# EAGLE design ESP32_mainboard (EAGLE 8.3.2)

## Sheet 1 of 2
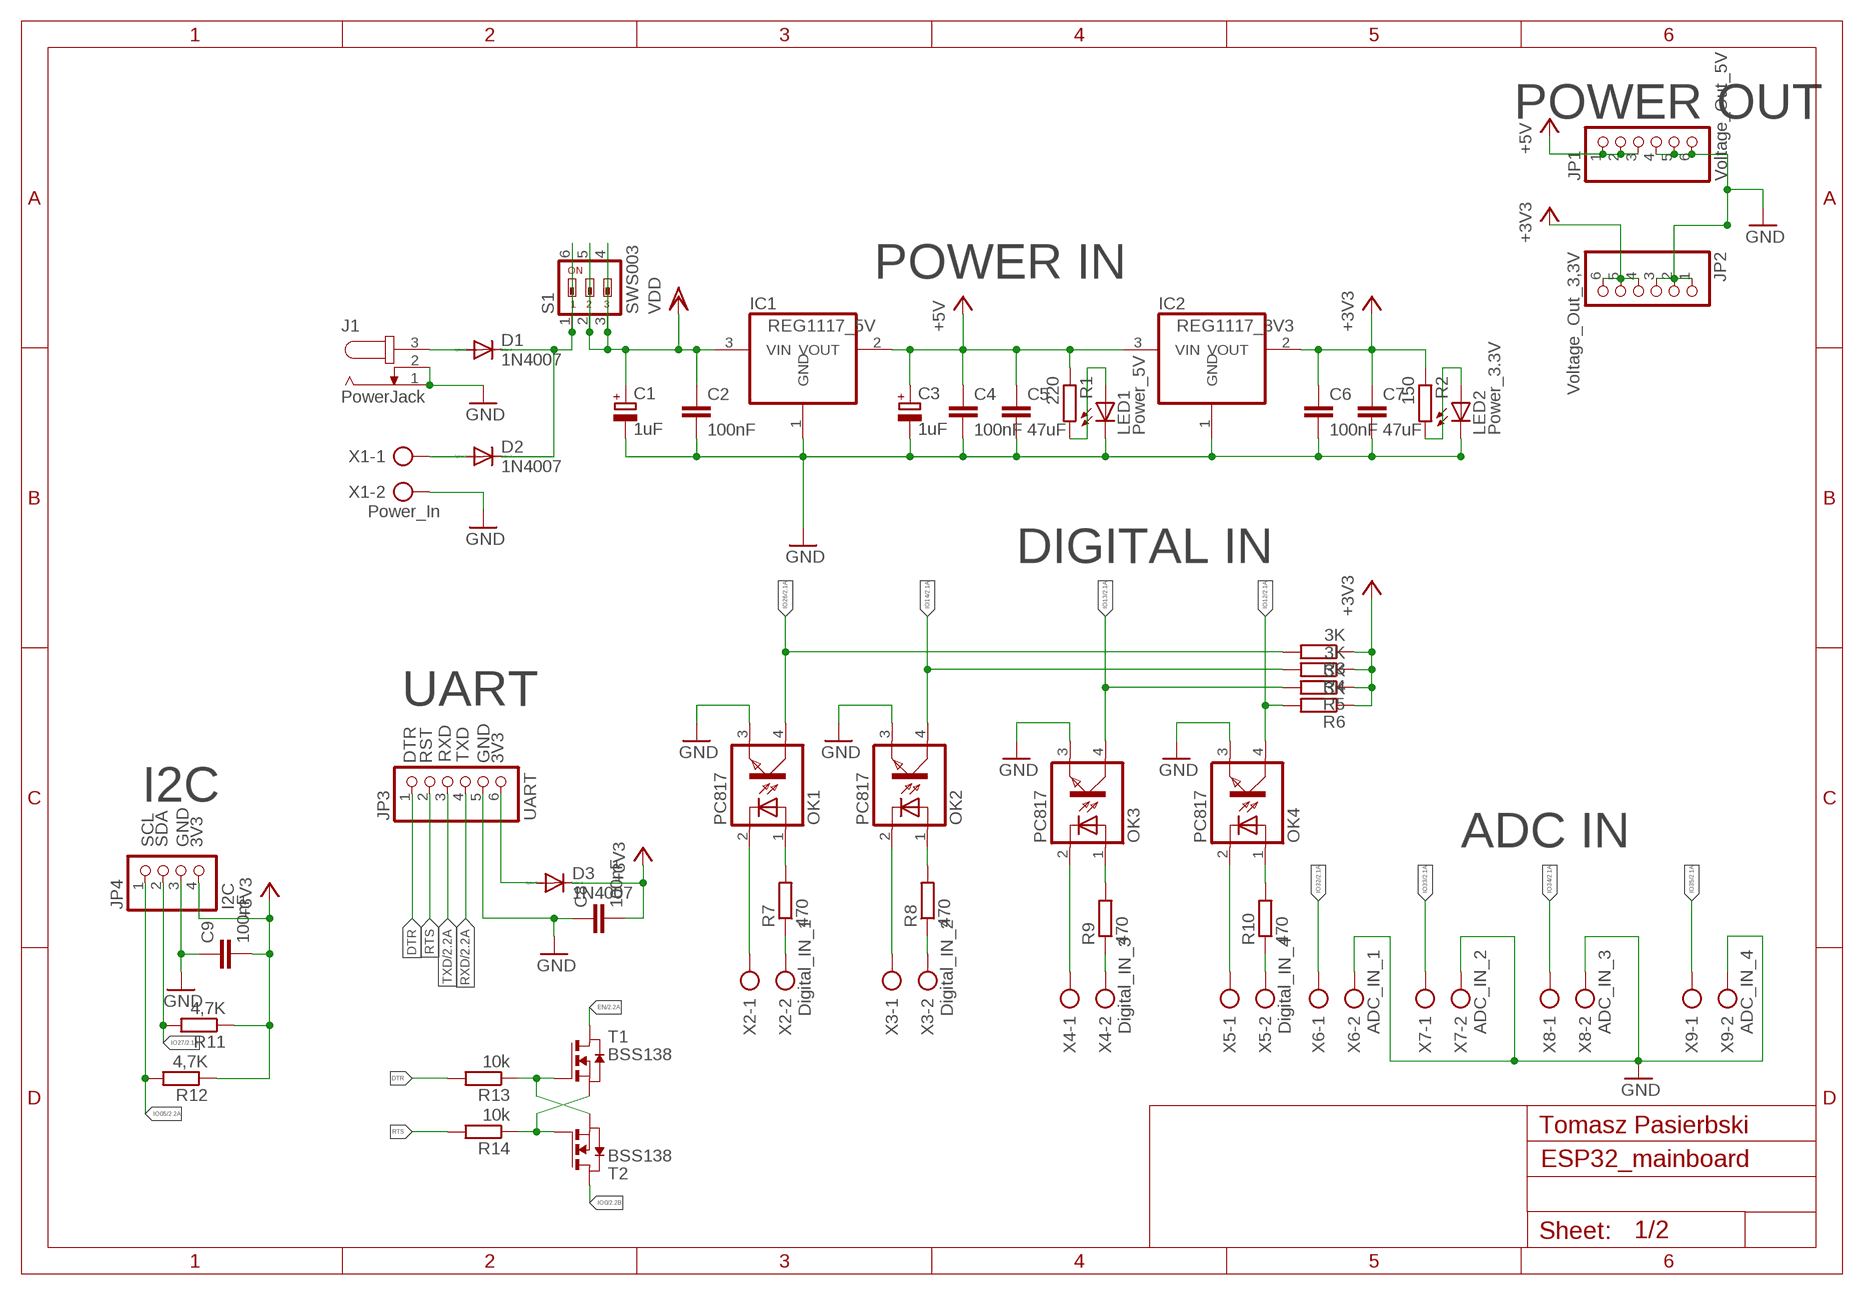
[diagram p0: schematic, sheet 1]

### Parts
C1  1uF  CPOL-EU140CLH-0810  [140CLH-0810]
C2  100nF  C-EUC1206  [C1206]
C3  1uF  CPOL-EU140CLH-0810  [140CLH-0810]
C4  100nF  C-EUC1206  [C1206]
C5  47uF  C-EUC1808  [C1808]
C6  100nF  C-EUC1206  [C1206]
C7  47uF  C-EUC1808  [C1808]
C8  100nF  C-EUC1206  [C1206]
C9  100nF  C-EUC1206  [C1206]
D1  1N4007  DIODE-DO214AA  [DO214AA]
D2  1N4007  DIODE-DO214AA  [DO214AA]
D3  1N4007  DIODE-DO214AA  [DO214AA]
IC1  REG1117_5V  REG1117  [SOT223]
IC2  REG1117_3V3  REG1117  [SOT223]
J1  PowerJack  JACK-PLUG0  [SPC4077]
JP1  Voltage_Out_5V  PINHD-1X6/90  [1X06/90]
JP2  Voltage_Out_3,3V  PINHD-1X6/90  [1X06/90]
JP3  UART  PINHD-1X6/90  [1X06/90]
JP4  I2C  PINHD-1X4/90  [1X04/90]
LED1  Power_5V  LEDCHIPLED_1206  [CHIPLED_1206]
LED2  Power_3.3V  LEDCHIPLED_1206  [CHIPLED_1206]
OK1  PC817  [DIL04]
OK2  PC817  [DIL04]
OK3  PC817  [DIL04]
OK4  PC817  [DIL04]
R1  220  R-EU_M1206  [M1206]
R2  150  R-EU_M1206  [M1206]
R3  3K  R-EU_M1206  [M1206]
R4  3K  R-EU_M1206  [M1206]
R5  3K  R-EU_M1206  [M1206]
R6  3K  R-EU_M1206  [M1206]
R7  470  R-EU_M1206  [M1206]
R8  470  R-EU_M1206  [M1206]
R9  470  R-EU_M1206  [M1206]
R10  470  R-EU_M1206  [M1206]
R11  4,7K  R-EU_M1206  [M1206]
R12  4,7K  R-EU_M1206  [M1206]
R13  10k  R-EU_M1206  [M1206]
R14  10k  R-EU_M1206  [M1206]
S1  SWS003  [SMS-003]
T1  BSS138  NMOSSOT23  [SOT-23]
T2  BSS138  NMOSSOT23  [SOT-23]
X1  Power_In  AK300/2  [AK300/2]
X2  Digital_IN_1  AK300/2  [AK300/2]
X3  Digital_IN_2  AK300/2  [AK300/2]
X4  Digital_IN_3  AK300/2  [AK300/2]
X5  Digital_IN_4  AK300/2  [AK300/2]
X6  ADC_IN_1  AK300/2  [AK300/2]
X7  ADC_IN_2  AK300/2  [AK300/2]
X8  ADC_IN_3  AK300/2  [AK300/2]
X9  ADC_IN_4  AK300/2  [AK300/2]

### Nets
+3V3: C6.1 C7.1 C8.2 C9.2 D3.C IC2.2(VOUT) JP2.4 JP2.5 JP2.6 JP4.4 R2.1 R3.1 R4.1 R5.1 R6.1 R11.1 R12.1 ; also sheet 2
+5V: C3.+ C4.1 C5.1 IC1.2(VOUT) IC2.3(VIN) JP1.1 JP1.2 JP1.3 R1.1 ; also sheet 2
DTR: JP3.1 R13.2
EN: T1.1(D) ; also sheet 2
GND: C1.- C2.2 C3.- C4.2 C5.2 C6.2 C7.2 C8.1 C9.1 IC1.1(GND) IC2.1(GND) J1.1 J1.2 JP1.4 JP1.5 JP1.6 JP2.1 JP2.2 JP2.3 JP3.5 JP4.3 LED1.C LED2.C OK1.3(EMIT) OK2.3(EMIT) OK3.3(EMIT) OK4.3(EMIT) X1.2 X6.2 X7.2 X8.2 X9.2 ; also sheet 2
IO0: T2.1(D) ; also sheet 2
IO05: JP4.1 R12.2 ; also sheet 2
IO12: OK4.4(COL) R6.2 ; also sheet 2
IO13: OK3.4(COL) R5.2 ; also sheet 2
IO14: OK2.4(COL) R4.2 ; also sheet 2
IO26: OK1.4(COL) R3.2 ; also sheet 2
IO27: JP4.2 R11.2 ; also sheet 2
IO32: X6.1 ; also sheet 2
IO33: X7.1 ; also sheet 2
IO34: X8.1 ; also sheet 2
IO35: X9.1 ; also sheet 2
N$1: D1.A J1.3
N$2: D1.C D2.C S1.1 S1.6
N$5: D2.A X1.1
N$22: D3.A JP3.6
N$24: LED1.A R1.2
N$32: LED2.A R2.2
N$39: OK3.2(C) X4.1
N$50: OK3.1(A) R9.2
N$58: OK1.2(C) X2.1
N$61: R13.1 T1.3(G) T2.2(S)
N$62: R14.1 T1.2(S) T2.3(G)
N$68: R9.1 X4.2
N$69: OK4.2(C) X5.1
N$70: OK4.1(A) R10.2
N$71: R10.1 X5.2
N$72: OK2.2(C) X3.1
N$73: OK2.1(A) R8.2
N$74: R8.1 X3.2
N$78: OK1.1(A) R7.2
N$79: R7.1 X2.2
RTS: JP3.2 R14.2
RXD: JP3.4 ; also sheet 2
TXD: JP3.3 ; also sheet 2
VDD: C1.+ C2.1 IC1.3(VIN) S1.2 S1.3 S1.4 S1.5 ; also sheet 2

### Notes on the sheet
- POWER OUT
- POWER IN
- DIGITAL IN
- UART
- DTR | RST | RXD | TXD | GND | 3V3
- I2C
- SCL | SDA | GND | 3V3 | ADC IN
- Tomasz Pasierbski

## Sheet 2 of 2
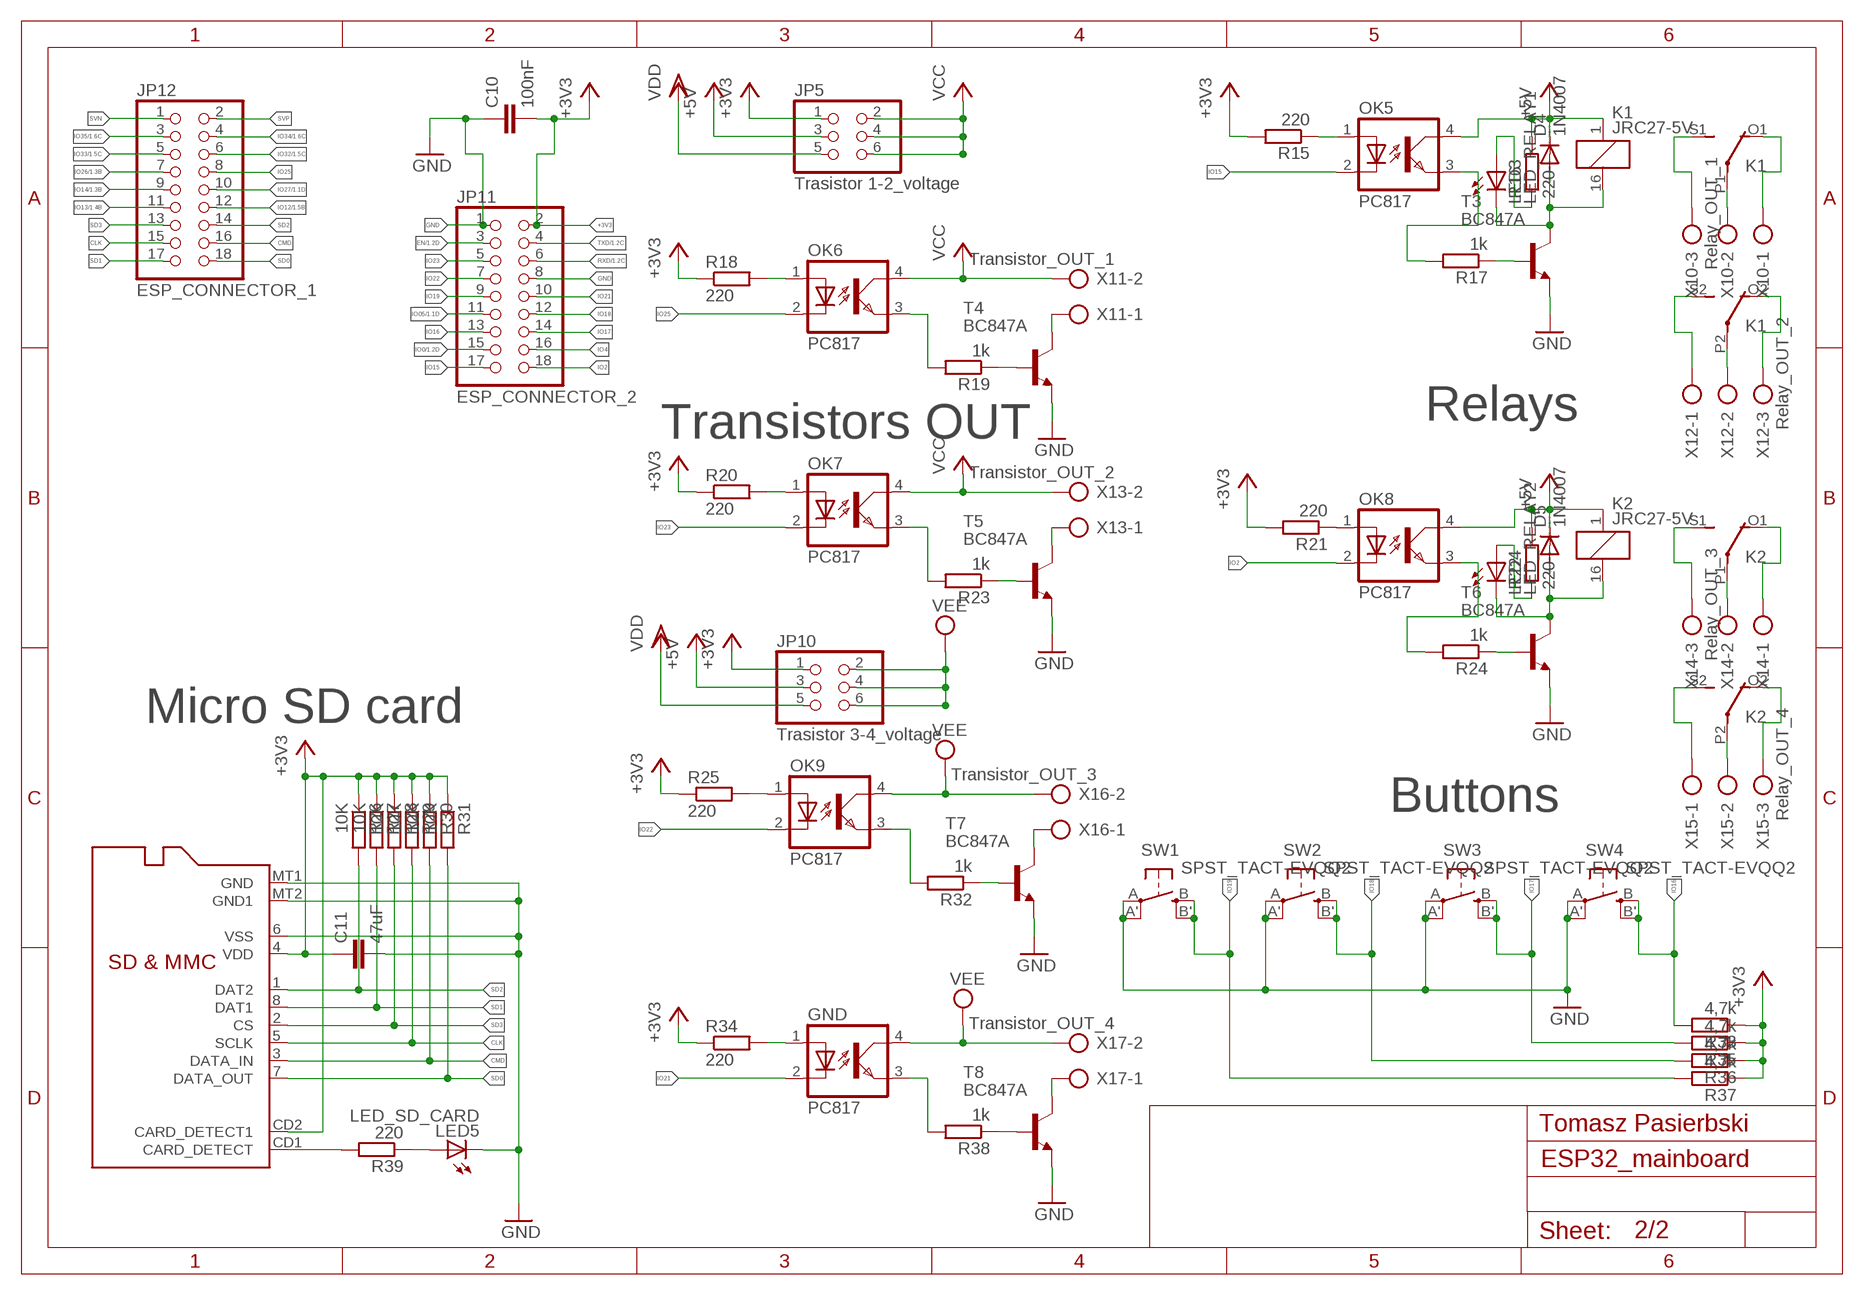
[diagram p1: schematic, sheet 2]

### Parts
C10  100nF  C-EUC1206  [C1206]
C11  47uF  C-EUC1808  [C1808]
D4  1N4007  DIODE-DO214AC  [DO214AC]
D5  1N4007  DIODE-DO214AC  [DO214AC]
GND  PC817  [DIL04]
JP5  Trasistor 1-2_voltage  PINHD-2X3  [2X03]
JP10  Trasistor 3-4_voltage  PINHD-2X3  [2X03]
JP11  ESP_CONNECTOR_2  PINHD-2X9  [2X09]
JP12  ESP_CONNECTOR_1  PINHD-2X9  [2X09]
K1  JRC27-5V  351  [351]
K2  JRC27-5V  351  [351]
LED3  LED_RELAY1  LEDCHIPLED_1206  [CHIPLED_1206]
LED4  LED_RELAY2  LEDCHIPLED_1206  [CHIPLED_1206]
LED5  LED_SD_CARD  LEDCHIPLED_1206  [CHIPLED_1206]
OK5  PC817  [DIL04]
OK6  PC817  [DIL04]
OK7  PC817  [DIL04]
OK8  PC817  [DIL04]
OK9  PC817  [DIL04]
R15  220  R-EU_M1206  [M1206]
R16  220  R-EU_M1206  [M1206]
R17  1k  R-EU_M1206  [M1206]
R18  220  R-EU_M1206  [M1206]
R19  1k  R-EU_M1206  [M1206]
R20  220  R-EU_M1206  [M1206]
R21  220  R-EU_M1206  [M1206]
R22  220  R-EU_M1206  [M1206]
R23  1k  R-EU_M1206  [M1206]
R24  1k  R-EU_M1206  [M1206]
R25  220  R-EU_M1206  [M1206]
R26  10K  R-EU_M1206  [M1206]
R27  10K  R-EU_M1206  [M1206]
R28  10K  R-EU_M1206  [M1206]
R29  10K  R-EU_M1206  [M1206]
R30  10K  R-EU_M1206  [M1206]
R31  10K  R-EU_M1206  [M1206]
R32  1k  R-EU_M1206  [M1206]
R33  4,7k  R-EU_M1206  [M1206]
R34  220  R-EU_M1206  [M1206]
R35  4,7k  R-EU_M1206  [M1206]
R36  4,7k  R-EU_M1206  [M1206]
R37  4,7k  R-EU_M1206  [M1206]
R38  1k  R-EU_M1206  [M1206]
R39  220  R-EU_M1206  [M1206]
SW1  SPST_TACT-EVQQ2  [EVQ-Q2]
SW2  SPST_TACT-EVQQ2  [EVQ-Q2]
SW3  SPST_TACT-EVQQ2  [EVQ-Q2]
SW4  SPST_TACT-EVQQ2  [EVQ-Q2]
T3  BC847A  BC847-NPN-SOT23-BEC  [SOT23-BEC]
T4  BC847A  BC847-NPN-SOT23-BEC  [SOT23-BEC]
T5  BC847A  BC847-NPN-SOT23-BEC  [SOT23-BEC]
T6  BC847A  BC847-NPN-SOT23-BEC  [SOT23-BEC]
T7  BC847A  BC847-NPN-SOT23-BEC  [SOT23-BEC]
T8  BC847A  BC847-NPN-SOT23-BEC  [SOT23-BEC]
U2  MICROSD  [MICROSD]
X10  Relay_OUT_1  AK300/3  [AK300/3]
X11  Transistor_OUT_1  AK300/2  [AK300/2]
X12  Relay_OUT_2  AK300/3  [AK300/3]
X13  Transistor_OUT_2  AK300/2  [AK300/2]
X14  Relay_OUT_3  AK300/3  [AK300/3]
X15  Relay_OUT_4  AK300/3  [AK300/3]
X16  Transistor_OUT_3  AK300/2  [AK300/2]
X17  Transistor_OUT_4  AK300/2  [AK300/2]

### Nets
+3V3: C10.2 C11.1 JP5.1 JP10.1 JP11.2 R15.2 R18.1 R20.1 R21.2 R25.1 R26.1 R27.1 R28.1 R29.1 R30.1 R31.1 R33.1 R34.1 R35.1 R36.1 R37.1 U2.4(VDD) U2.CD2(CARD_DETECT1) ; also sheet 1
+5V: D4.C D5.C JP5.3 JP10.3 K1.1 K2.1 OK5.4(COL) OK8.4(COL) R16.2 R22.2 ; also sheet 1
CLK: JP12.15 R29.2 U2.5(SCLK)
CMD: JP12.16 R30.2 U2.3(DATA_IN)
EN: JP11.3 ; also sheet 1
GND: C10.1 C11.2 JP11.1 JP11.8 LED5.C SW1.A'(P1) SW1.A(P) SW2.A'(P1) SW2.A(P) SW3.A'(P1) SW3.A(P) SW4.A'(P1) SW4.A(P) T3.E T4.E T5.E T6.E T7.E T8.E U2.6(VSS) U2.MT1(GND) U2.MT2(GND1) ; also sheet 1
IO0: JP11.15 ; also sheet 1
IO2: JP11.18 OK8.2(C)
IO4: JP11.16
IO05: JP11.11 ; also sheet 1
IO12: JP12.12 ; also sheet 1
IO13: JP12.11 ; also sheet 1
IO14: JP12.9 ; also sheet 1
IO15: JP11.17 OK5.2(C)
IO16: JP11.13 R33.2 SW4.B'(S1) SW4.B(S)
IO17: JP11.14 R35.2 SW3.B'(S1) SW3.B(S)
IO18: JP11.12 R36.2 SW2.B'(S1) SW2.B(S)
IO19: JP11.9 R37.2 SW1.B'(S1) SW1.B(S)
IO21: GND.2(C) JP11.10
IO22: JP11.7 OK9.2(C)
IO23: JP11.5 OK7.2(C)
IO25: JP12.8 OK6.2(C)
IO26: JP12.7 ; also sheet 1
IO27: JP12.10 ; also sheet 1
IO32: JP12.6 ; also sheet 1
IO33: JP12.5 ; also sheet 1
IO34: JP12.4 ; also sheet 1
IO35: JP12.3 ; also sheet 1
N$6: K1.S1(2:S) X10.3
N$7: K1.O1(2:O) X10.1
N$8: K1.P1(2:P) X10.2
N$9: K1.S2(3:S) X12.1
N$10: K1.P2(3:P) X12.2
N$11: K1.O2(3:O) X12.3
N$12: K2.O1(2:O) X14.1
N$13: K2.S1(2:S) X14.3
N$14: K2.P1(2:P) X14.2
N$15: K2.S2(3:S) X15.1
N$16: K2.O2(3:O) X15.3
N$17: K2.P2(3:P) X15.2
N$18: OK8.1(A) R21.1
N$19: OK5.1(A) R15.1
N$25: R17.1 T3.B
N$26: OK5.3(EMIT) R17.2
N$27: OK8.3(EMIT) R24.2
N$28: D4.A K1.16 LED3.C T3.C
N$30: R24.1 T6.B
N$37: LED3.A R16.1
N$42: OK6.1(A) R18.2
N$43: OK7.1(A) R20.2
N$46: D5.A K2.16 LED4.C T6.C
N$47: LED4.A R22.1
N$51: R19.1 T4.B
N$52: OK6.3(EMIT) R19.2
N$53: R39.2 U2.CD1(CARD_DETECT)
N$54: T4.C X11.1
N$55: R23.1 T5.B
N$56: OK7.3(EMIT) R23.2
N$57: T5.C X13.1
N$59: LED5.A R39.1
N$63: OK9.1(A) R25.2
N$64: R32.1 T7.B
N$65: OK9.3(EMIT) R32.2
N$66: T7.C X16.1
N$67: GND.1(A) R34.2
N$75: R38.1 T8.B
N$76: GND.3(EMIT) R38.2
N$77: T8.C X17.1
RXD: JP11.6 ; also sheet 1
SD0: JP12.18 R31.2 U2.7(DATA_OUT)
SD1: JP12.17 R27.2 U2.8(DAT1)
SD2: JP12.14 R26.2 U2.1(DAT2)
SD3: JP12.13 R28.2 U2.2(CS)
SVN: JP12.1
SVP: JP12.2
TXD: JP11.4 ; also sheet 1
VCC: JP5.2 JP5.4 JP5.6 OK6.4(COL) OK7.4(COL) X11.2 X13.2
VDD: JP5.5 JP10.5 ; also sheet 1
VEE: GND.4(COL) JP10.2 JP10.4 JP10.6 OK9.4(COL) X16.2 X17.2

### Notes on the sheet
- Relays
- Transistors OUT
- Micro SD card
- Buttons
- Tomasz Pasierbski

## Library data of the parts
C1 C3 = rcl:CPOL-EU: POLARIZED CAPACITOR, European symbol
C2 C4-C11 = rcl:C-EU: CAPACITOR, European symbol
D1-D5 = diode:DIODE-: DIODE
GND OK1-OK9 = optocoupler:PC817: SHARP OPTO COUPLER; MPN: PC817X4J000F; OC_FARNELL: 9707727; OC_NEWARK: 97K7059
IC1 IC2 = burr-brown:REG1117: 800mA and 1A Low Dropout (LDO) Positive Regulator 1.8V, 2.5V, 2.85V, 3.3V, 5V, and Adj; MPN: REG1117; OC_FARNELL: 1097566; OC_NEWARK: 14P6981
J1 = con-jack:JACK-PLUG: DC POWER JACK Power Jack, DC, Right Angle, Through Hole, Rated 5A at 16VDC, PC Terminals Distributor: Farnell (www.Farnell.de) Drawing: 84N1161.pdf / 84N1162.pdf Manufacturer: SPC Technology (www.spctechnology.com) Type: SPC4077 / SPC 4078; OC_FARNELL: unknown; OC_NEWARK: unknown
JP1-JP3 = pinhead:PINHD-1X6: PIN HEADER
JP4 = pinhead:PINHD-1X4: PIN HEADER
JP5 JP10 = pinhead:PINHD-2X3: PIN HEADER
JP11 JP12 = pinhead:PINHD-2X9: PIN HEADER
K1 K2 = relay:351: RELAY 2 x switch, Omron; OC_FARNELL: unknown; OC_NEWARK: unknown
LED1-LED5 = led:LED: LED OSRAM: - CHIPLED LG R971, LG N971, LY N971, LG Q971, LY Q971, LO R971, LY R971 LH N974, LH R974 LS Q976, LO Q976, LY Q976 LO Q996 - Hyper CHIPLED LW Q18S LB Q993, LB Q99A, LB R99A - SideLED LS A670, LO A670, LY A670, LG A670, LP A670 LB A673, LV A673, LT A673, LW A673 LH A674 LY A675 LS A676, LA A676, LO A676, LY A676, LW A676 LS A679, LY A679, LG A679 - Hyper Micro SIDELED® LS Y876, LA Y876, LO Y876, LY Y876 LT Y87S - SmartLED LW L88C, LW L88S LB L89C, LB L89S, LG L890 LS L89K, LO L89K, LY L89K LS L896, LA L896, LO L896, LY L896 - TOPLED LS T670, LO T670, LY T670, LG T670, LP T670 LSG T670, LSP T670, LSY T670, LOP T670, LYG T670 LG T671, LOG T671, LSG T671 LB T673, LV T673, LT T673, LW T673 LH T674 LS T676, LA T676, LO T676, LY T676, LB T676, LH T676, LSB T676, LW T676 LB T67C, LV T67C, LT T67C, LS T67K, LO T67K, LY T67K, LW E67C LS E67B, LA E67B, LO E67B, LY E67B, LB E67C, LV E67C, LT E67C LW T67C LS T679, LY T679, LG T679 LS T770, LO T770, LY T770, LG T770, LP T770 LB T773, LV T773, LT T773, LW T773 LH T774 LS E675, LA E675, LY E675, LS T675 LS T776, LA T776, LO T776, LY T776, LB T776 LHGB T686 LT T68C, LB T68C - Hyper Mini TOPLED® LB M676 - Mini TOPLED Santana® LG M470 LS M47K, LO M47K, LY M47K Source: http://www.osram.convergy.de LUXEON: - LUMILED® LXK2-PW12-R00, LXK2-PW12-S00, LXK2-PW14-U00, LXK2-PW14-V00 LXK2-PM12-R00, LXK2-PM12-S00, LXK2-PM14-U00 LXK2-PE12-Q00, LXK2-PE12-R00, LXK2-PE12-S00, LXK2-PE14-T00, LXK2-PE14-U00 LXK2-PB12-K00, LXK2-PB12-L00, LXK2-PB12-M00, LXK2-PB14-N00, LXK2-PB14-P00, LXK2-PB14-Q00 LXK2-PR12-L00, LXK2-PR12-M00, LXK2-PR14-Q00, LXK2-PR14-R00 LXK2-PD12-Q00, LXK2-PD12-R00, LXK2-PD12-S00 LXK2-PH12-R00, LXK2-PH12-S00 LXK2-PL12-P00, LXK2-PL12-Q00, LXK2-PL12-R00 Source: www.luxeon.com KINGBRIGHT: KA-3528ASYC Source: www.kingbright.com
R1-R39 = rcl:R-EU_: RESISTOR, European symbol
S1 = smd-special:SWS003: SMD Dip Switch 3 pol.
SW1-SW4 = adafruit:SPST_TACT: SMT 6mm switch, EVQQ2 series http://www.ladyada.net/library/eagle
T1 T2 = zetex:NMOSSOT23: MOS FET; OC_FARNELL: unknown; OC_NEWARK: unknown
T3-T8 = transistor:*-NPN-: NPN Transistror BF959 corrected 2008.03.06
U2 = adafruit:MICROSD: Micro-SD / Transflash card holder with SPI pinout For the 3M # 2908-05WB-MG and/or 4UCON #19656 push-push type
X1-X9 X11 X13 X16 X17 = con-ptr500:AK300/2: CONNECTOR; OC_FARNELL: unknown; OC_NEWARK: unknown
X10 X12 X14 X15 = con-ptr500:AK300/3: CONNECTOR; OC_FARNELL: unknown; OC_NEWARK: unknown

## Board
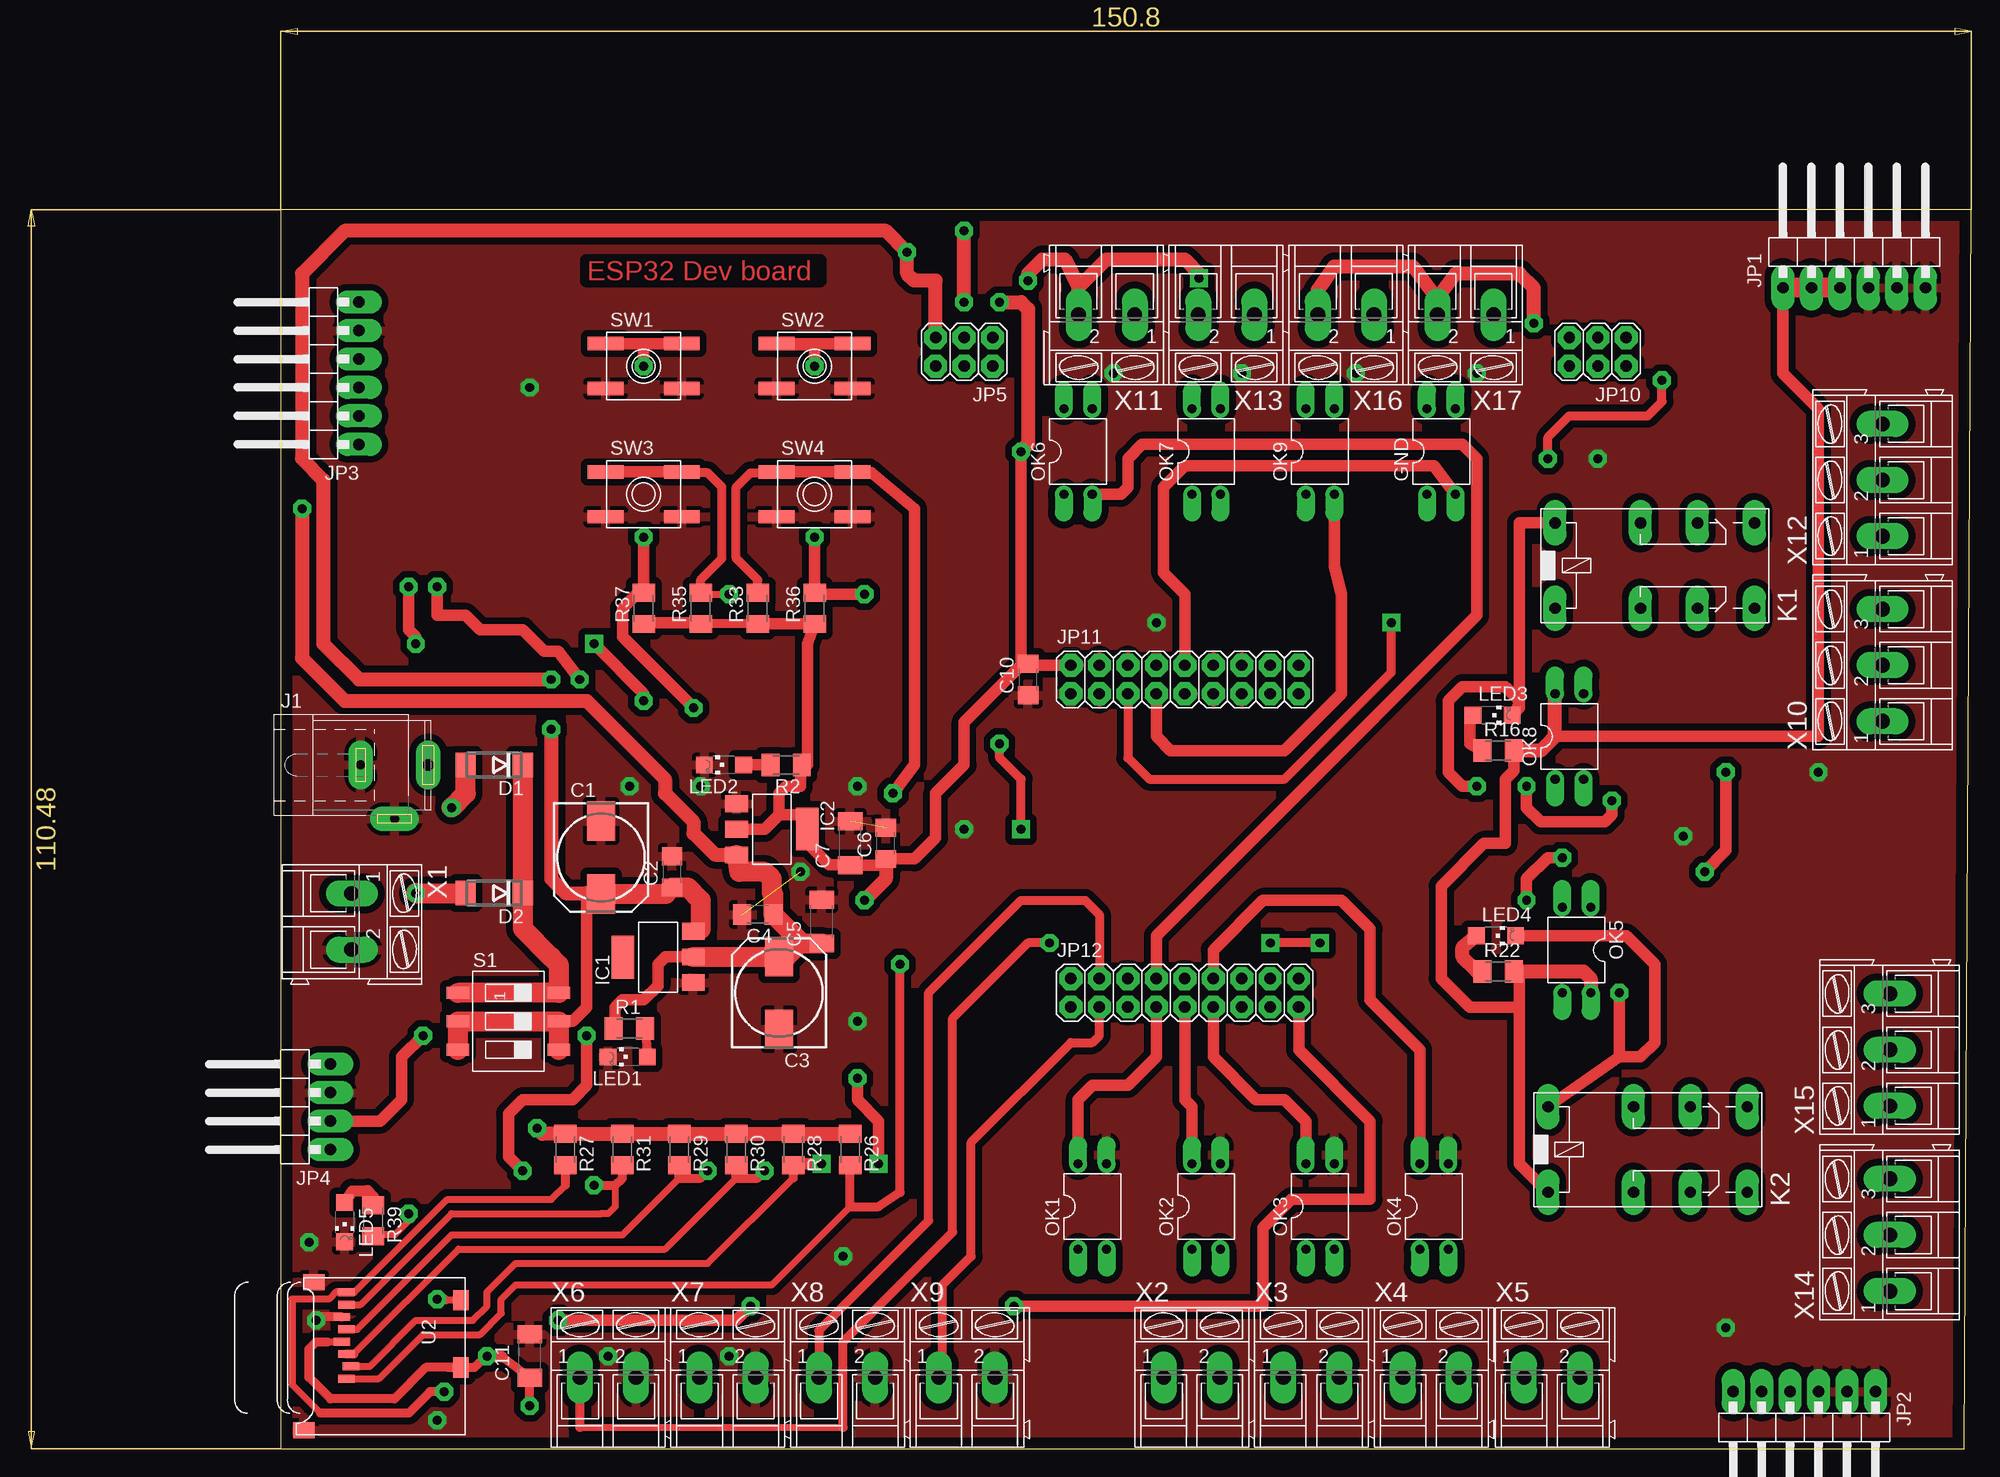
[diagram p2: board, top side]
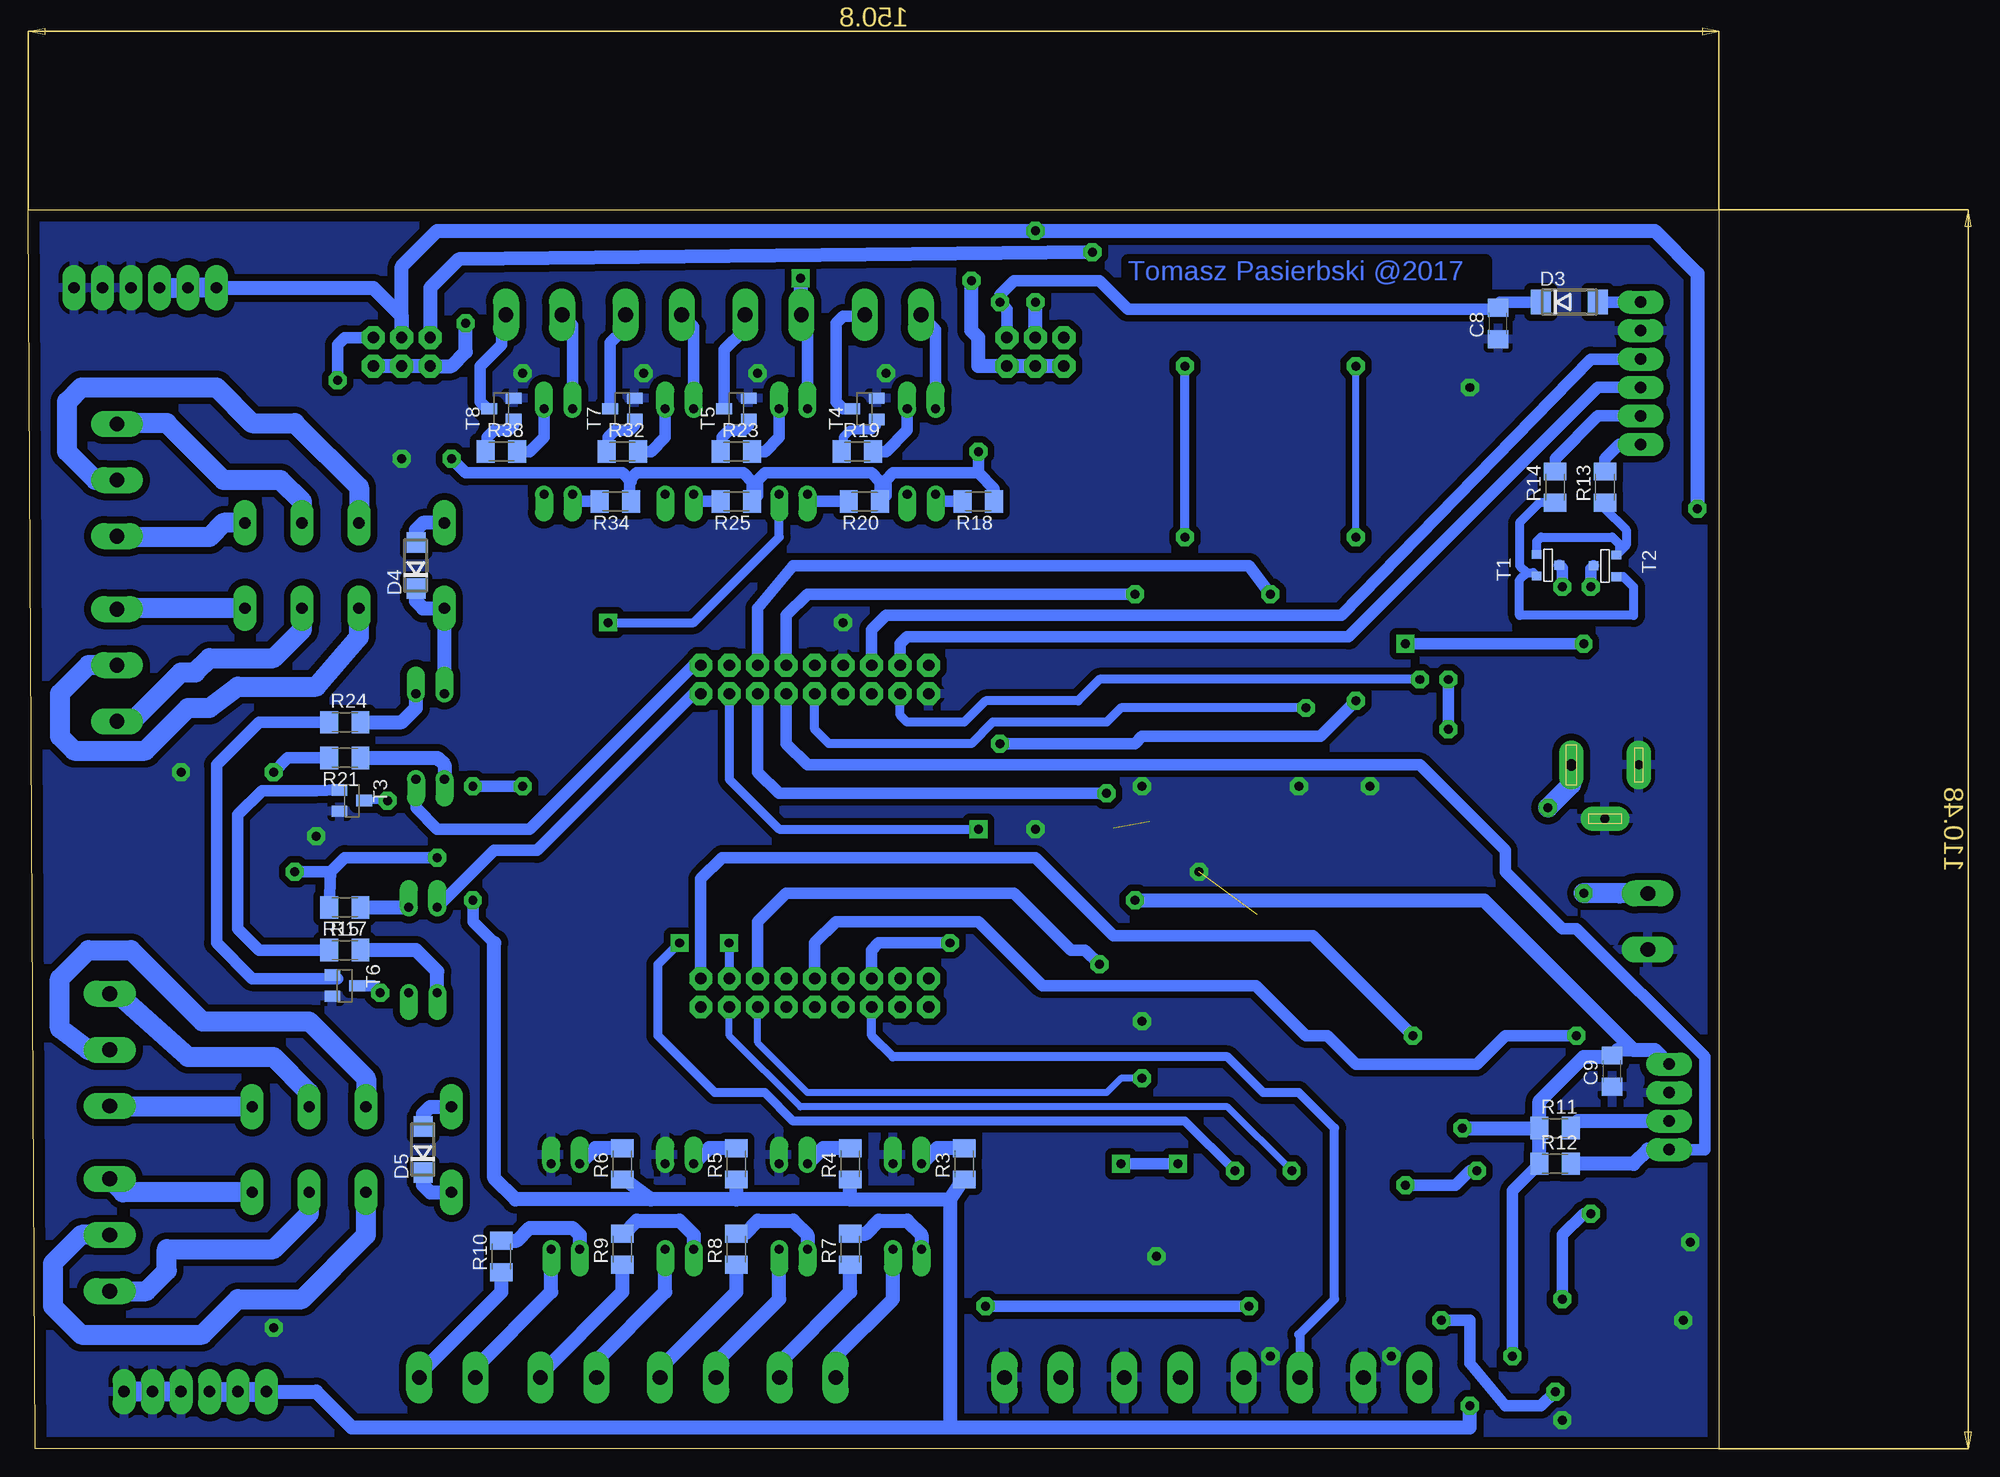
[diagram p3: board, bottom side, seen from below]

Size 150.8 x 110.48 mm. Coordinates in mm from the lower left corner, seen from the top.
Outline: 0,0 150.16,0 150.8,110.48 0,110.48 0,0
Copper layers (1*16): Top 0.035mm / dielectric 1.5mm / Bottom 0.035mm
Design rules "default *": minimum track width 20mil, minimum drill 24mil, track to track 12mil, track to pad 12mil, pad to pad 12mil, via to via 12mil, smd to smd 12mil, copper to edge 40mil, drill to drill 12mil, minimum pad ring 10mil, minimum via ring 8mil, stop-mask expansion 4mil, vias tented up to drill 0mil, thermal gap 15mil

### Footprints (pad centres in the part's own frame; a part is rotated, then mirrored left to right if it is on the bottom)
140CLH-0810 = smd 3.5 x 2.5: + 3.25,0; - -3.25,0
C1206 = smd 1.6 x 1.8: 1 -1.4,0; 2 1.4,0
C1808 = smd 1.6 x 2.2: 1 -1.95,0; 2 1.95,0
DO214AA = smd 1.8 x 2.2: A 2.55,0; C -2.55,0
DO214AC = smd 1.8 x 1.7: A 2.05,0; C -2.05,0
DIL04 = drill 0.813 offset: 1 -1.27,-3.81; 2 1.27,-3.81; 3 1.27,3.81; 4 -1.27,3.81
SOT223 = smd 1.499 x 2.007: 1 -2.261,-3.15; 2 0.025,-3.15; 3 2.311,-3.15 | smd 3.81 x 2.007: 4 0,3.15
SPC4077 = drill 0.8 pad 2.184 long: 1 -3,0; 2 0,-4.8 | drill 1 pad 2.184 long: 3 3,0
1X06/90 = drill 1.016 long: 1 -6.35,-3.81; 2 -3.81,-3.81; 3 -1.27,-3.81; 4 1.27,-3.81; 5 3.81,-3.81; 6 6.35,-3.81
1X04/90 = drill 1.016 long: 1 -3.81,-3.81; 2 -1.27,-3.81; 3 1.27,-3.81; 4 3.81,-3.81
2X03 = drill 1.016 octagon: 1 -2.54,-1.27; 2 -2.54,1.27; 3 0,-1.27; 4 0,1.27; 5 2.54,-1.27; 6 2.54,1.27
2X09 = drill 1.016 octagon: 1 -10.16,-1.27; 2 -10.16,1.27; 3 -7.62,-1.27; 4 -7.62,1.27; 5 -5.08,-1.27; 6 -5.08,1.27; 7 -2.54,-1.27; 8 -2.54,1.27; 9 0,-1.27; 10 0,1.27; 11 2.54,-1.27; 12 2.54,1.27; 13 5.08,-1.27; 14 5.08,1.27; 15 7.62,-1.27; 16 7.62,1.27; 17 10.16,-1.27; 18 10.16,1.27
351 = drill 1.016 long: 1 -3.81,-3.81; 16 -3.81,3.81; O1 8.89,-3.81; O2 8.89,3.81; P1 3.81,-3.81; P2 3.81,3.81; S1 13.97,-3.81; S2 13.97,3.81
CHIPLED_1206 = smd 1.5 x 1.5: A 0,-1.75; C 0,1.75
M1206 = smd 1.6 x 2: 1 -1.4,0; 2 1.4,0
SMS-003 = smd 1.092 x 2.007: 1 -2.54,-4.496; 2 0,-4.496; 3 2.54,-4.496; 4 2.54,4.496; 5 0,4.496; 6 -2.54,4.496
EVQ-Q2 = smd 3.2 x 1.2: A -3.4,-2; A' 3.4,-2; B -3.4,2; B' 3.4,2
SOT-23 = smd 0.787 x 0.889: 1 0.025,-1.016; 2 -0.94,1.016; 3 0.991,1.016
SOT23-BEC = smd 1 x 1.4: B -0.95,-1.1; C 0,1.1; E 0.95,-1.1
MICROSD = smd 0.7 x 1.5: 1 9,-10.64; 2 7.9,-10.24; 3 6.8,-10.64; 4 5.7,-11.04; 5 4.6,-10.64; 6 3.5,-11.04; 7 2.4,-10.64; 8 1.3,-10.64 | smd 1.8 x 1.4: CD1 2,-0.44; CD2 8,-0.44 | smd 1.4 x 1.9: MT1 0.4,-13.54; MT2 13.6,-14.44
AK300/2 = drill 1.321 long: 1 -2.515,0; 2 2.489,0
AK300/3 = drill 1.321 long: 1 -5.004,0; 2 0,0; 3 5.004,0

### Placement (x,y rotation side)
C1  28.57,52.7 270 top
C2  34.92,51.44 90 top
C3  44.45,40.64 90 top
C4  42.55,47.62 180 top
C5  48.26,46.99 90 top
C6  53.98,53.98 90 top
C7  50.8,53.98 90 top
C8  19.68,100.33 90 bottom
C9  9.53,33.66 90 bottom
C10  66.67,68.58 90 top
C11  22.23,8.26 90 top
D1  19.05,60.96 180 top
D2  19.05,49.53 180 top
D3  13.34,102.23 0 bottom
D4  116.2,78.74 90 bottom
D5  115.57,26.67 90 bottom
GND  103.5,88.9 0 top
IC1  33.66,43.81 90 top
IC2  43.81,55.24 270 top
J1  10.16,60.96 0 top
JP1  140.34,107.31 0 top
JP2  135.89,1.27 180 top
JP3  3.17,95.89 90 top
JP4  0.64,30.48 90 top
JP5  60.96,97.79 180 top
JP10  117.47,97.79 180 top
JP11  80.64,68.58 0 top
JP12  80.64,40.64 0 top
K1  117.47,78.74 0 top
K2  116.84,26.67 0 top
LED1  30.96,34.92 90 top
LED2  39.54,60.96 90 top
LED3  108.09,65.41 270 top
LED4  108.4,45.72 270 top
LED5  5.71,20.2 180 top
OK1  72.39,21.59 0 top
OK2  82.55,21.59 0 top
OK3  92.71,21.59 0 top
OK4  102.87,21.59 0 top
OK5  115.57,44.45 180 top
OK6  71.12,88.9 0 top
OK7  82.55,88.9 0 top
OK8  114.94,63.5 0 top
OK9  92.71,88.9 0 top
R1  31.11,37.47 0 top
R2  45.09,60.96 180 top
R3  67.31,25.4 90 bottom
R4  77.47,25.4 90 bottom
R5  87.63,25.4 90 bottom
R6  97.79,25.4 90 bottom
R7  77.47,17.78 90 bottom
R8  87.63,17.78 90 bottom
R9  97.79,17.78 90 bottom
R10  108.58,17.14 90 bottom
R11  14.61,28.57 0 bottom
R12  14.61,25.4 0 bottom
R13  10.16,85.72 90 bottom
R14  14.61,85.72 90 bottom
R15  122.56,48.26 180 bottom
R16  108.58,62.23 0 top
R17  122.56,44.45 0 bottom
R18  66.04,84.45 180 bottom
R19  76.83,88.9 0 bottom
R20  76.2,84.45 180 bottom
R21  122.56,61.59 180 bottom
R22  108.58,42.55 0 top
R23  87.63,88.9 0 bottom
R24  122.56,64.77 0 bottom
R25  87.63,84.45 180 bottom
R26  50.8,26.67 270 top
R27  25.4,26.67 270 top
R28  45.72,26.67 270 top
R29  35.56,26.67 270 top
R30  40.64,26.67 270 top
R31  30.48,26.67 270 top
R32  97.79,88.9 0 bottom
R33  42.55,74.93 90 top
R34  98.42,84.45 180 bottom
R35  37.47,74.93 90 top
R36  47.62,74.93 90 top
R37  32.38,74.93 90 top
R38  108.58,88.9 0 bottom
R39  8.26,20.32 270 top
S1  20.32,38.1 270 top
SW1  32.38,96.52 0 top
SW2  47.62,96.52 0 top
SW3  32.38,85.09 0 top
SW4  47.62,85.09 0 top
T1  15.24,78.74 90 bottom
T2  10.16,78.74 270 bottom
T3  121.92,57.78 270 bottom
T4  76.2,92.71 90 bottom
T5  87.63,92.71 90 bottom
T6  122.56,41.27 270 bottom
T7  97.79,92.71 90 bottom
T8  108.58,92.71 90 bottom
U2  16.51,15.24 270 top
X1  6.35,46.99 270 top
X2  81.28,6.35 0 top
X3  91.95,6.35 0 top
X4  102.62,6.35 0 top
X5  113.41,6.35 0 top
X6  29.21,6.35 0 top
X7  39.88,6.35 0 top
X8  50.55,6.35 0 top
X9  61.21,6.35 0 top
X10  142.88,69.85 90 top
X11  73.66,101.09 180 top
X12  142.88,86.36 90 top
X13  84.33,101.09 180 top
X14  143.51,19.05 90 top
X15  143.51,35.56 90 top
X16  95,101.09 180 top
X17  105.66,101.09 180 top

### Tracks (layer width: path | path; a pad name or v marks a point on that pad's centre or on a via)
+3V3  (via drill 0.8)
  Top 0.61: 36.96,73.53 36.83,73.66 | 32.52,73.66 R37.1 | 4.18,9.53 U2.4 | U2.CD2 14.98,7.24
  Top 0.813: R33.1 38.1,73.53 | 38.1,73.53 R35.1 | R35.1 36.96,73.53 | U2.CD2 12.96,7.24 10.16,4.45 4.45,4.45 2.54,6.35 2.54,8.89 3.17,9.53 4.18,9.53 | 19.73,8.21 C11.1 v22.23,3.81 | v18.41,8.26 17.27,7.24 14.98,7.24 | v113.03,88.27 113.03,90.17 114.94,92.08 121.92,92.08 123.19,93.34 v123.19,95.25 | R35.1 37.47,73.66 38.1,73.53
  Top 1.016: R33.1 R36.1 46.99,71.75 46.99,60.96 R2.1 46.35,60.83 46.35,59.05 45.09,59.05 44.45,58.42 44.45,56.52 | 36.83,73.66 32.52,73.66 | IC2.2 43.16,55.22 44.45,56.52 | 44.45,56.52 46.99,56.52 46.99,53.98 48.9,52.07 50.76,52.07 C7.1 53.42,52.02 C6.1 56.52,52.58 58.42,54.48 58.42,58.42 60.96,60.96 60.96,64.77 66.04,69.85 | 19.73,8.21 v18.41,8.26 | 71.12,69.85 JP11.2 67.31,69.85 C10.2 66.04,69.85 | v66.04,88.9 66.04,69.85 | v127,51.44 128.91,53.34 v128.91,60.33 | v114.3,52.7 113.03,52.7 111.12,50.8 v111.12,48.9
  Top 1.27: R26.1 R28.1 R30.1 R29.1 R31.1 R27.1 23.36,28.07 v22.86,28.57 | C6.1 53.98,50.8 v52.07,48.9 | v64.14,102.23 66.04,102.23 66.67,101.6 66.67,89.53 v66.04,88.9
  Bottom 0.813: 74.3,84.96 R20.1 | 97.16,84.58 R34.1 97.03,86.23 | 20.32,101.6 C8.2 | 67.31,24.13 R3.1 | 97.79,24.13 R6.1
  Bottom 1.016: D3.C 19.55,102.23 C8.2 | v18.41,8.26 18.41,22.99 R12.1 | R18.1 64.64,85.59 66.04,87 | 66.04,87 73.66,87 74.3,86.36 74.3,84.96 | R20.1 74.8,86.23 75.56,87 85.09,87 85.72,86.36 85.72,84.96 R25.1 86.23,86.23 87,87 96.52,87 97.16,86.36 97.16,84.58 | 97.03,86.23 97.79,87 111.76,87 v113.03,88.27 | v123.19,95.25 123.19,98.42 122.56,99.06 JP10.1 | JP5.1 63.5,101.6 v64.14,102.23 64.14,102.87 62.87,104.14 55.24,104.14 52.7,101.6 20.32,101.6 | v66.04,88.9 66.04,87 | 123.83,51.44 122.56,52.7 v114.3,52.7 | 123.83,51.44 R15.2 | R21.2 127.64,61.59 v128.91,60.33 | v127,51.44 123.83,51.44 | v111.12,48.9 111.12,46.99 109.22,45.09
  Bottom 1.27: JP4.4 5.71,35.56 7.62,35.56 | 7.62,35.56 9.02,35.56 C9.2 9.65,34.92 12.06,34.92 16,30.98 R11.1 | R12.1 R11.1 | v22.86,28.57 R11.1 | v52.07,48.9 20.95,48.9 7.62,35.56 | JP2.6 125.09,5.08 121.92,1.91 68.58,1.91 | 68.58,1.91 22.23,1.91 v22.23,3.81 | 77.47,22.23 68.58,22.23 | 68.58,22.23 67.31,24.13 | 77.47,22.23 87.63,22.23 | 77.47,22.23 R4.1 | 87.63,22.23 95.25,22.23 | 95.25,22.23 97.79,24.13 | 87.63,22.23 R5.1 | 109.22,45.09 109.22,24.13 107.31,22.23 95.25,22.23 | 68.58,22.23 68.58,1.91
  Bottom 1.778: JP2.4 JP2.5 JP2.6
+5V  (via drill 0.8)
  Top 0.61: 29.84,37.59 R1.1
  Top 0.813: 110.49,41.91 R22.2
  Top 1.016: IC1.2 34.31,43.84 33.66,43.18 33.66,41.27 32.38,40.01 30.48,40.01 29.84,39.37 29.84,37.59 | K2.1 110.49,25.4 110.49,39.37 | 110.49,39.37 110.49,41.91 | JP1.1 133.99,95.89 137.16,92.71 137.16,63.5 113.79,63.5 113.35,63.18 | R16.2 109.98,60.45 109.22,59.69 109.22,53.98 107.31,53.98 103.5,50.16 103.5,41.91 106.05,39.37 110.49,39.37
  Top 1.27: v1.91,83.82 1.91,70.48 5.71,66.67 27.3,66.67 34.29,59.69 34.29,58.42 36.83,55.88 36.83,54.86 38.73,52.96 40.64,52.96 IC2.3 | v60.96,102.23 v60.96,108.58 | R16.2 112.39,62.23 113.35,63.18 113.67,63.5 OK8.4 | R22.2 116.2,42.55 116.84,41.91 OK5.4
  Top 1.778: IC1.2 44.4,43.84 C3.+ 45.16,43.89 46.35,45.09 | 46.35,45.09 46.35,45.22 C4.1 43.95,49.4 43.81,49.53 43.81,50.8 43.18,51.44 40.89,51.44 IC2.3 | C5.1 46.4,45.04 46.35,45.09 | JP1.3 JP1.1
  Bottom 1.27: JP1.1 120.02,103.5 117.47,100.97 JP10.3 117.47,105.41 114.3,108.58 v60.96,108.58 5.71,108.58 1.91,104.78 v1.91,83.82 | D5.C 115.57,23.5 114.94,22.86 K2.1 | D4.C 116.2,75.56 115.57,74.93 K1.1 OK8.4 | JP5.3 v60.96,102.23
  Bottom 1.778: JP1.3 JP1.2 JP1.1
CLK  (via drill 0.8)
  Top 0.61: U2.5 6.83,10.64 15.24,19.05 30.48,19.05 35.56,24.13
  Top 0.813: R29.2 35.56,24.13 37.47,24.13 v38.1,24.77 | 88.27,38.73 JP12.15
  Bottom 0.61: JP12.15 88.27,36.83 81.92,30.48 43.81,30.48 v38.1,24.77
CMD  (via drill 0.8)
  Top 0.61: 6.54,8.44 15.88,17.78 34.29,17.78 40.64,24.13
  Top 0.813: U2.3 6.54,8.44 | R30.2 40.64,24.13 42.55,24.13 v43.18,24.77 | 88.27,42.55 JP12.16 | v92.71,45.09 v88.27,45.09
  Bottom 0.813: v88.27,45.09 JP12.16 | v43.18,24.77 47.62,29.21 82.55,29.21 85.09,31.75 89.53,31.75 94.61,36.83 94.61,43.18 v92.71,45.09
DTR
  Bottom 1.016: R13.2 10.16,88.27 8.89,89.53 JP3.1
EN  (via drill 0.8)
  Top 1.016: 73.03,66.67 JP11.3 | v26.67,68.58 24.77,71.12 23.5,71.12 21.59,73.03 17.78,73.03 16.51,74.3 13.97,74.3 v13.97,76.83
  Bottom 0.813: JP11.3 73.03,65.41 72.39,64.77 67.31,64.77 65.41,66.67 57.15,66.67 55.24,68.58 v26.67,68.58
  Bottom 1.016: v13.97,76.83 13.97,78.51 T1.1
GND  (via drill 0.8)  (2 unrouted)
  Top 0.813: U2.6 3.48,11.74 v3.17,11.43
  Bottom 1.778: JP2.3 JP2.1
  other vias: 74.3,95.89 85.72,95.89 95.89,95.89 106.68,95.89 51.44,59.05 46.35,51.44 60.96,55.24 125.09,54.61 137.16,60.33 128.91,10.79 31.11,59.05 37.47,59.05 78.11,73.66 117.47,88.27 29.21,8.26 40.01,8.26 2.54,18.41 50.16,17.14 13.97,2.54 51.44,38.1 22.23,94.61
  pour Bottom (isolate 0.61): -0.64,111.12 152.4,111.12 151.76,-1.27 -1.91,-1.27
  pour Top (isolate 0.61): -0.64,111.12 152.4,111.12 151.76,-1.27 -1.91,-1.27
IO0  (via drill 0.8)
  Top 0.813: v66.04,55.24 66.04,59.69 64.14,61.59 v64.14,62.87
  Top 1.016: v32.38,66.67 32.38,67.31 v27.94,71.75 | v12.06,71.75 12.06,72.39 11.43,73.03 v11.43,76.83
  Bottom 0.813: JP11.15 88.27,59.69 83.82,55.24 v66.04,55.24
  Bottom 1.016: v64.14,62.87 52.07,62.87 51.44,63.5 35.56,63.5 v32.38,66.67 | v11.43,76.83 11.43,78.46 T2.1 | v27.94,71.75 v12.06,71.75
IO2
  Top 0.813: 90.81,70.48 JP11.18
  Bottom 1.016: OK8.2 116.2,57.15 114.3,55.24 106.05,55.24 91.44,69.85 JP11.18
IO05
  Top 1.016: 83.19,66.67 JP11.11
  Bottom 1.016: JP11.11 83.19,62.87 81.28,60.96 26.67,60.96 19.05,53.34 19.05,51.44 13.97,46.35 12.7,46.35 1.27,34.92 1.27,26.67 JP4.1
  Bottom 1.27: JP4.1 6.35,26.67 7.62,25.4 R12.2
IO12
  Top 1.016: JP12.12 83.19,44.45 87.63,48.9 94.61,48.9 97.16,46.35 97.16,40.01 101.6,35.56 OK4.4
  Bottom 1.27: R6.2 100.2,26.8 OK4.4
IO13
  Top 1.016: JP12.11 83.19,34.92 87,31.11 89.53,31.11 91.44,29.21 OK3.4
  Bottom 1.27: R5.2 90.04,26.8 OK3.4
IO14
  Top 1.016: OK2.4 81.28,30.48 80.64,31.11 JP12.9
  Bottom 1.27: R4.2 79.88,26.8 OK2.4
IO15
  Top 0.813: 90.81,66.67 JP11.17
  Bottom 1.016: OK5.2 109.22,53.34 105.41,53.34 91.44,67.31 JP11.17
IO16  (via drill 0.8)
  Top 0.61: 44.13,87 SW4.B
  Top 0.813: R33.2 42.55,77.47 40.64,79.38 40.64,85.72 41.91,87 44.13,87
  Top 1.016: SW4.B SW4.B' 52.7,87 56.52,83.82 56.52,60.96 v54.61,58.42 | 85.72,66.67 JP11.13
  Bottom 1.016: JP11.13 85.72,60.33 83.82,58.42 v54.61,58.42
IO17  (via drill 0.8)
  Top 0.61: 35.88,87 SW3.B' | 38.1,76.2 v40.01,76.2
  Top 0.813: 35.88,87 38.1,87 39.37,85.72 39.37,79.38 37.47,77.47 R35.2 38.1,76.2
  Top 1.016: SW3.B' SW3.B | 85.72,70.48 JP11.14
  Bottom 1.016: JP11.14 85.72,74.93 82.55,78.74 41.91,78.74 v40.01,76.2
IO18  (via drill 0.8)
  Top 0.61: 44.32,98.42 SW2.B
  Top 0.813: 48.26,76.2 R36.2
  Top 1.016: R36.2 v47.62,81.28 | v47.62,96.52 47.62,98.42 44.32,98.42 | SW2.B' SW2.B | 83.19,70.48 JP11.12 | 48.26,76.2 v52.07,76.2
  Bottom 0.813: v47.62,81.28 v47.62,96.52
  Bottom 1.016: JP11.12 83.19,74.3 81.28,76.2 v52.07,76.2
IO19  (via drill 0.8)
  Top 0.813: 31.75,76.2 R37.2
  Top 1.016: SW1.B' 32.38,98.52 | 32.38,98.52 SW1.B | R37.2 v32.38,81.28 | v32.38,96.52 32.38,98.52 | 81.28,67.31 JP11.9 | v36.83,66.04 30.48,72.39 30.48,74.93 31.75,76.2
  Bottom 0.61: v32.38,81.28 v32.38,96.52
  Bottom 0.813: JP11.9 80.64,64.14 79.38,62.87 66.67,62.87 64.77,64.77 54.61,64.77 53.34,66.04 v36.83,66.04
IO21
  Top 1.016: GND.2 102.87,87.63 80.64,87.63 78.74,85.72 78.74,78.11 80.64,76.2 JP11.10
IO22
  Top 1.016: OK9.2 93.98,78.74 94.61,76.2 94.61,67.31 89.53,62.23 79.38,62.23 78.11,63.5 JP11.7
IO23  (via drill 0.8)
  Top 0.813: JP11.5 75.56,61.59 77.47,59.69 89.53,59.69 99.06,69.22 v99.06,73.66
  Bottom 0.813: v99.06,73.66 91.44,73.66 83.82,81.28 OK7.2
IO25
  Top 1.016: OK6.2 74.93,85.09 75.56,85.72 75.56,88.27 76.83,89.53 105.41,89.53 106.68,88.27 106.68,74.3 78.11,45.72 JP12.8
IO26
  Top 1.016: JP12.7 78.11,38.73 78.11,34.92 75.56,32.38 72.39,32.38 71.12,31.11 OK1.4
  Bottom 1.27: R3.2 69.72,26.8 OK1.4
IO27  (via drill 0.8)
  Top 0.813: 80.64,42.55 JP12.10 | 5.08,29.21 JP4.2
  Top 1.016: 5.08,29.21 8.89,29.21 10.79,31.11 10.79,34.92 v12.7,36.83
  Bottom 1.016: JP12.10 80.64,45.09 78.74,46.99 66.04,46.99 60.33,41.27 41.27,41.27 36.83,36.83 34.92,36.83 32.38,34.29 21.59,34.29 19.05,36.83 v12.7,36.83
  Bottom 1.27: JP4.2 12.57,29.21 R11.2
IO32  (via drill 0.8)
  Top 0.61: 26.67,1.91 50.16,1.91
  Top 0.813: 75.56,42.55 JP12.6 | 50.16,1.91 50.16,9.53 59.94,19.3 59.94,38.35 66.67,45.09 v68.58,45.09 | 26.67,1.91 26.67,5.08 X6.1
  Bottom 1.016: JP12.6 75.56,44.45 74.93,45.09 v68.58,45.09
IO33
  Top 0.813: 75.56,38.73 JP12.5
  Bottom 0.61: 37.47,10.16 37.36,10.06
  Bottom 0.813: JP12.5 75.56,36.83 73.66,34.92 43.81,34.92 40.64,31.75 37.47,31.75 34.29,28.57 34.29,13.34 37.47,10.16 | 37.36,10.06 X7.1
IO34
  Top 0.813: JP12.4 73.03,47.62 71.75,48.9 66.04,48.9 57.78,40.64 57.78,20.32 48.01,10.54 X8.1
IO35
  Top 0.813: 73.03,38.73 JP12.3 73.03,36.83 72.39,36.2 70.48,36.2 61.59,27.3 61.59,17.14 59.05,14.61 59.05,6.99 X9.1
N$1  (via drill 0.8)
  Top 1.778: v15.24,57.15 16.51,58.42 D1.A
  Bottom 1.778: J1.3 13.16,59.23 v15.24,57.15
N$2
  Top 1.778: D1.C D2.C 21.6,46.4 24.13,43.81 24.82,43.13 S1.6 S1.1
N$5  (via drill 0.8)
  Top 1.778: v12.06,49.53 D2.A
  Bottom 1.778: X1.1 8.87,49.51 v12.06,49.53
N$6
  Bottom 1.778: K1.S1 142.8,74.93 X10.3
N$7
  Bottom 1.778: X10.1 141.53,64.85 137.16,69.22 135.89,69.22 134.62,70.48 128.91,70.48 126.36,73.03 K1.O1
N$8
  Bottom 1.778: X10.2 145.41,69.85 147.96,67.31 147.96,63.5 146.69,62.23 140.34,62.23 136.53,66.04 134.62,66.04 132.08,67.94 125.09,67.94 121.28,72.39 K1.P1
N$9
  Bottom 1.778: K1.S2 133.35,82.55 134.62,81.28 142.8,81.28 X12.1
N$10
  Bottom 1.778: X12.2 144.78,86.36 147.32,88.9 147.32,93.34 146.05,94.61 133.99,94.61 130.81,91.44 127,91.44 121.28,85.72 K1.P2
N$11
  Bottom 1.778: K1.O2 126.36,84.45 128.27,86.36 133.35,86.36 138.43,91.44 142.8,91.44 X12.3
N$12
  Bottom 1.778: X14.1 140.26,14.05 138.43,15.88 138.43,17.78 128.91,17.78 125.73,20.95 K2.O1
N$13
  Bottom 1.778: K2.S1 142.32,22.86 X14.3
N$14
  Bottom 1.778: X14.2 146.05,19.05 148.59,16.51 148.59,12.7 146.05,10.16 135.25,10.16 132.08,13.34 126.36,13.34 120.65,19.05 K2.P1
N$15
  Bottom 1.778: K2.S2 143.43,30.48 X15.1
N$16
  Bottom 1.778: X15.3 142.8,40.56 136.53,34.92 128.91,34.92 125.73,31.75 K2.O2
N$17
  Bottom 1.778: X15.2 145.41,35.56 147.96,37.47 147.96,41.91 145.41,44.45 141.6,44.45 135.25,38.1 125.73,38.1 120.65,33.02 K2.P2
N$18
  Bottom 1.27: R21.1 114.3,61.59 113.67,60.96 OK8.1
N$19
  Bottom 1.27: R15.1 OK5.1
N$22
  Bottom 1.016: JP3.6 D3.A
N$24
  Top 0.813: R1.2 LED1.A
N$25
  Bottom 1.016: R17.1 130.18,44.45 132.08,46.35 132.08,56.52 129.92,58.67 125.09,58.67 T3.B
N$26
  Bottom 1.27: OK5.3 114.3,42.55 116.2,44.45 R17.2
N$27
  Bottom 1.27: R24.2 117.47,64.77 116.2,66.04 OK8.3
N$28  (via drill 0.8)
  Top 0.61: LED3.C 110.41,66.76
  Top 0.813: 114.3,82.55 K1.16
  Top 1.016: K1.16 110.49,82.55 110.49,66.04 LED3.C | 110.41,66.76 109.22,67.94 105.41,67.94 104.14,66.67 104.14,60.33 105.41,59.05 v106.68,59.05 | v111.12,59.05 111.12,57.15 112.39,55.88 118.11,55.88 118.75,56.52 v118.75,57.78
  Bottom 0.61: v118.75,57.78 T3.C
  Bottom 1.016: v106.68,59.05 v111.12,59.05
  Bottom 1.27: K1.16 115.57,82.55 116.2,81.92 D4.A
N$30
  Bottom 0.813: 123.19,41.91 T6.B
  Bottom 1.016: 123.19,41.91 130.81,41.91 133.99,45.09 133.99,60.96 130.18,64.77 R24.1
N$32
  Top 1.016: R2.2 LED2.A
N$37
  Top 1.016: R16.1 106.05,62.87 106.05,64.77 LED3.A
N$39
  Bottom 1.27: X4.1 100.1,7.85 93.98,13.97 OK3.2
N$42
  Bottom 1.016: R18.2 69.22,84.45 OK6.1
N$43
  Bottom 1.016: R20.2 80.64,84.45 OK7.1
N$46  (via drill 0.8)
  Top 0.61: 111.12,45.72 LED4.C
  Top 1.016: 111.12,45.72 120.02,45.72 122.56,43.18 122.56,36.2 121.28,34.92 119.38,34.92 | K2.16 119.38,34.92 | v119.38,40.64 119.38,34.92
  Bottom 1.016: T6.C 120.02,41.27 v119.38,40.64
  Bottom 1.27: D5.A 115.57,29.84 114.94,30.48 K2.16
N$47
  Top 1.27: R22.1 106.68,42.55 105.41,43.81 105.41,44.7 LED4.A
N$50
  Bottom 1.27: R9.2 97.66,19.18 96.52,20.32 92.71,20.32 91.44,19.05 OK3.1
N$51
  Bottom 0.813: T4.B 75.1,91.27 75.56,90.81 77.47,90.81 78.11,90.17 78.11,89.03 R19.1
N$52
  Bottom 1.016: R19.2 74.3,88.9 72.39,90.81 OK6.3
N$53  (via drill 0.8)
  Top 0.61: U2.CD1 14.7,13.24 | v11.43,20.95 11.43,20.32 10.16,19.05 8.38,19.05
  Top 0.813: 14.7,13.24 v13.97,13.34 | 8.38,19.05 R39.2
  Bottom 1.016: v13.97,13.34 13.97,19.05 12.06,20.95 v11.43,20.95
N$54
  Bottom 0.61: 76.3,100.97 X11.1
  Bottom 1.016: T4.C 78.11,92.71 78.74,93.34 78.74,100.33 78.11,100.97 76.3,100.97
N$55
  Bottom 0.813: T5.B 86.53,91.27 | 88.9,89.03 R23.1
  Bottom 1.016: 86.53,91.27 87,90.81 88.27,90.81 88.9,90.17 88.9,89.03
N$56
  Bottom 1.016: R23.2 85.09,88.9 83.82,90.17 OK7.3
N$57
  Bottom 0.813: 87,100.94 X13.1
  Bottom 1.016: T5.C 88.73,97.96 87,99.69 87,100.94
N$58
  Bottom 1.27: X2.1 78.77,8.23 73.66,13.34 OK1.2
N$59
  Top 1.016: LED5.A 6.38,22.96 7.75,22.99 8.26,22.48 R39.1
N$61
  Bottom 0.813: T1.3 16.26,80.9 15.88,81.28 9.53,81.28 8.89,80.64 8.89,79.93 T2.2 8.26,80.57 8.26,81.92 10.16,83.82 R13.1
N$62
  Bottom 0.813: T2.3 8.53,77.75 7.62,76.83 7.62,74.3 17.78,74.3 17.78,77.47 17.14,78.11 | 17.14,78.11 16.56,78.11 T1.2 | R14.1 16,84.33 17.78,82.55 17.78,78.74 17.14,78.11
N$63
  Bottom 1.016: R25.2 90.81,84.45 OK9.1
N$64
  Bottom 0.813: T7.B 96.69,91.27 | 99.06,89.03 R32.1
  Bottom 1.016: 96.69,91.27 97.16,90.81 98.42,90.81 99.06,90.17 99.06,89.03
N$65
  Bottom 1.016: R32.2 95.25,88.9 93.98,90.17 OK9.3
N$66
  Bottom 0.813: 97.79,100.81 X16.1
  Bottom 1.016: T7.C 98.89,98.59 97.79,99.69 97.79,100.81
N$67
  Bottom 1.016: R34.2 101.6,84.45 GND.1
N$68
  Bottom 1.27: X4.2 105.11,6.66 97.79,13.97 R9.1
N$69
  Bottom 1.27: X5.1 110.9,7.21 104.14,13.97 OK4.2
N$70
  Bottom 1.27: R10.2 107.19,18.55 106.05,19.68 102.23,19.68 101.6,19.05 OK4.1
N$71
  Bottom 1.27: X5.2 115.9,6.66 108.58,13.97 R10.1
N$72
  Bottom 1.27: X3.1 89.43,7.72 83.82,13.34 OK2.2
N$73
  Bottom 1.27: R8.2 86.86,19.18 85.72,20.32 82.55,20.32 81.28,19.05 OK2.1
N$74
  Bottom 1.27: X3.2 94.44,7.16 87.63,13.97 R8.1
N$75
  Bottom 0.813: 107.48,91.27 107.95,90.81 | 109.86,89.03 R38.1
  Bottom 1.016: T8.B 107.48,91.27 | 107.95,90.81 109.22,90.81 109.86,90.17 109.86,89.03
N$76
  Bottom 1.016: R38.2 106.05,88.9 104.78,90.17 GND.3
N$77
  Bottom 0.813: T8.C 109.86,92.71 | 108.58,100.69 X17.1
  Bottom 1.016: 109.86,92.71 110.49,93.34 110.49,96.52 108.58,98.42 108.58,100.69
N$78
  Bottom 1.27: R7.2 76.07,19.18 74.93,20.32 72.39,20.32 71.12,19.05 OK1.1
N$79
  Bottom 1.27: X2.2 83.77,7.67 77.47,13.97 R7.1
RTS
  Bottom 1.016: R14.2 14.61,88.27 10.79,92.08 JP3.2
RXD
  Top 1.016: 75.56,70.48 JP11.6
  Bottom 1.016: JP11.6 75.56,73.03 74.3,74.3 33.66,74.3 11.43,97.16 JP3.4
SD0  (via drill 0.8)
  Top 0.61: U2.7 7.12,12.84 15.24,20.95 28.57,20.95 29.21,20.95 29.84,21.59 29.84,23.5
  Top 0.813: R31.2 30.48,24.13 29.84,23.5 v27.94,23.5 | 90.81,42.55 JP12.18
  Top 1.016: v27.3,36.83 27.3,32.38 26.04,31.11 21.59,31.11 20.32,29.84 20.32,26.04 v21.59,24.77
  Bottom 1.016: JP12.18 90.81,50.8 88.9,52.7 60.96,52.7 53.98,45.72 36.2,45.72 v27.3,36.83 | v21.59,24.77 22.23,24.77 23.5,23.5 v27.94,23.5
SD1  (via drill 0.8)
  Top 0.61: 25.4,23.5 24.13,22.23 14.86,22.23 6.57,13.94 U2.8 5.08,13.97 4.95,13.97 4.32,13.34 1.02,13.34 1.02,5.71 3.56,3.17
  Top 0.813: 25.4,23.5 R27.2 | v14.61,5.08 13.34,5.08 11.43,3.17 3.56,3.17
  Top 1.016: JP12.17 90.81,35.56 97.16,29.21 97.16,22.23 90.17,22.23 87.63,19.68 87.63,12.7 v65.41,12.7 | v41.91,12.7 40.64,11.43 v24.77,11.43
  Bottom 1.016: v24.77,11.43 22.23,11.43 22.23,7.62 19.05,3.81 15.88,3.81 v14.61,5.08 | v65.41,12.7 v41.91,12.7
SD2  (via drill 0.8)
  Top 0.61: U2.1 8.78,6.24 12.7,10.16 17.78,10.16 19.68,12.06 19.68,13.34 20.95,14.61 43.81,14.61 50.8,21.59
  Top 0.813: R26.2 50.8,21.59 53.34,21.59 55.24,22.86 v55.24,43.18 | 85.72,42.55 JP12.14
  Bottom 1.016: JP12.14 85.72,46.99 83.19,49.53 62.87,49.53 57.78,44.45 56.52,44.45 v55.24,43.18
SD3  (via drill 0.8)
  Top 0.61: U2.2 7.97,7.34 12.06,11.43 17.14,11.43 18.41,12.7 18.41,13.97 20.95,16.51 38.1,16.51 45.72,24.13 | 45.85,25.4 R28.2
  Top 0.813: R28.2 45.72,24.13 | 85.72,38.73 JP12.13
  Top 1.016: v51.44,33.02 51.44,31.11 53.34,29.21 v53.34,25.4 | v48.26,25.4 45.85,25.4
  Bottom 0.61: JP12.13 85.72,36.2 81.28,31.75 54.61,31.75 53.34,33.02 v51.44,33.02
  Bottom 1.016: v53.34,25.4 v48.26,25.4
TXD
  Top 1.016: 73.03,70.48 JP11.4
  Bottom 1.016: JP11.4 73.03,71.75 72.39,72.39 33.02,72.39 10.79,94.61 JP3.3
VCC  (via drill 0.8)
  Top 1.27: X11.2 71.17,103.56 | 71.17,103.56 73.66,106.05 80.64,106.05 81.92,104.78 v81.92,104.34 | v66.67,104.14 66.67,104.78 67.94,106.05 69.95,106.05 71.17,103.56
  Bottom 1.016: OK6.4 69.85,99.77 X11.2 | OK7.4 81.28,100.53
  Bottom 1.27: v81.92,104.34 X13.2 81.28,100.53 | JP5.6 JP5.4 JP5.2 66.04,96.52 66.04,99.06 66.67,99.69 v66.67,104.14
VDD  (via drill 0.8)
  Top 1.016: S1.5 26.04,38.1 27.3,39.37 27.3,49.53
  Top 1.27: 37.47,46.35 37.03,46.35 IC1.3 | JP5.5 58.42,104.14 56.52,104.14 55.88,104.78 v55.88,106.68 53.98,108.58 5.71,108.58 1.91,104.78 1.91,88.27 3.81,86.36 3.81,71.75 6.99,68.58 v24.13,68.58 | v24.13,64.14 24.13,50.8 25.4,49.53 27.3,49.53 28.5,49.53 C1.+
  Top 1.778: S1.3 S1.2 S1.5 S1.4 | C1.+ 34.34,49.45 C2.1 36.33,50.03 37.47,48.9 37.47,46.35
  Bottom 1.016: v24.13,68.58 v24.13,64.14
  Bottom 1.27: v55.88,106.68 112.39,106.05 114.94,103.5 JP10.5
VEE  (via drill 0.8)
  Top 1.27: X16.2 92.51,103.3 93.98,105.41 100.97,105.41 102.87,102.87 102.87,102.23 | 102.87,102.23 102.87,101.4 X17.2 | v111.76,100.33 111.76,103.5 110.49,104.78 104.78,104.78 102.87,102.23
  Bottom 1.016: OK9.4 91.44,100.03 X16.2 | GND.4 102.23,100.15 X17.2
  Bottom 1.27: v111.76,100.33 111.76,97.79 113.03,96.52 JP10.6 JP10.4 JP10.2

### Text on the board
Top: ESP32 Dev board
Bottom: Tomasz Pasierbski @2017